# EAGLE schematic pic32 (EAGLE 9.3.0)
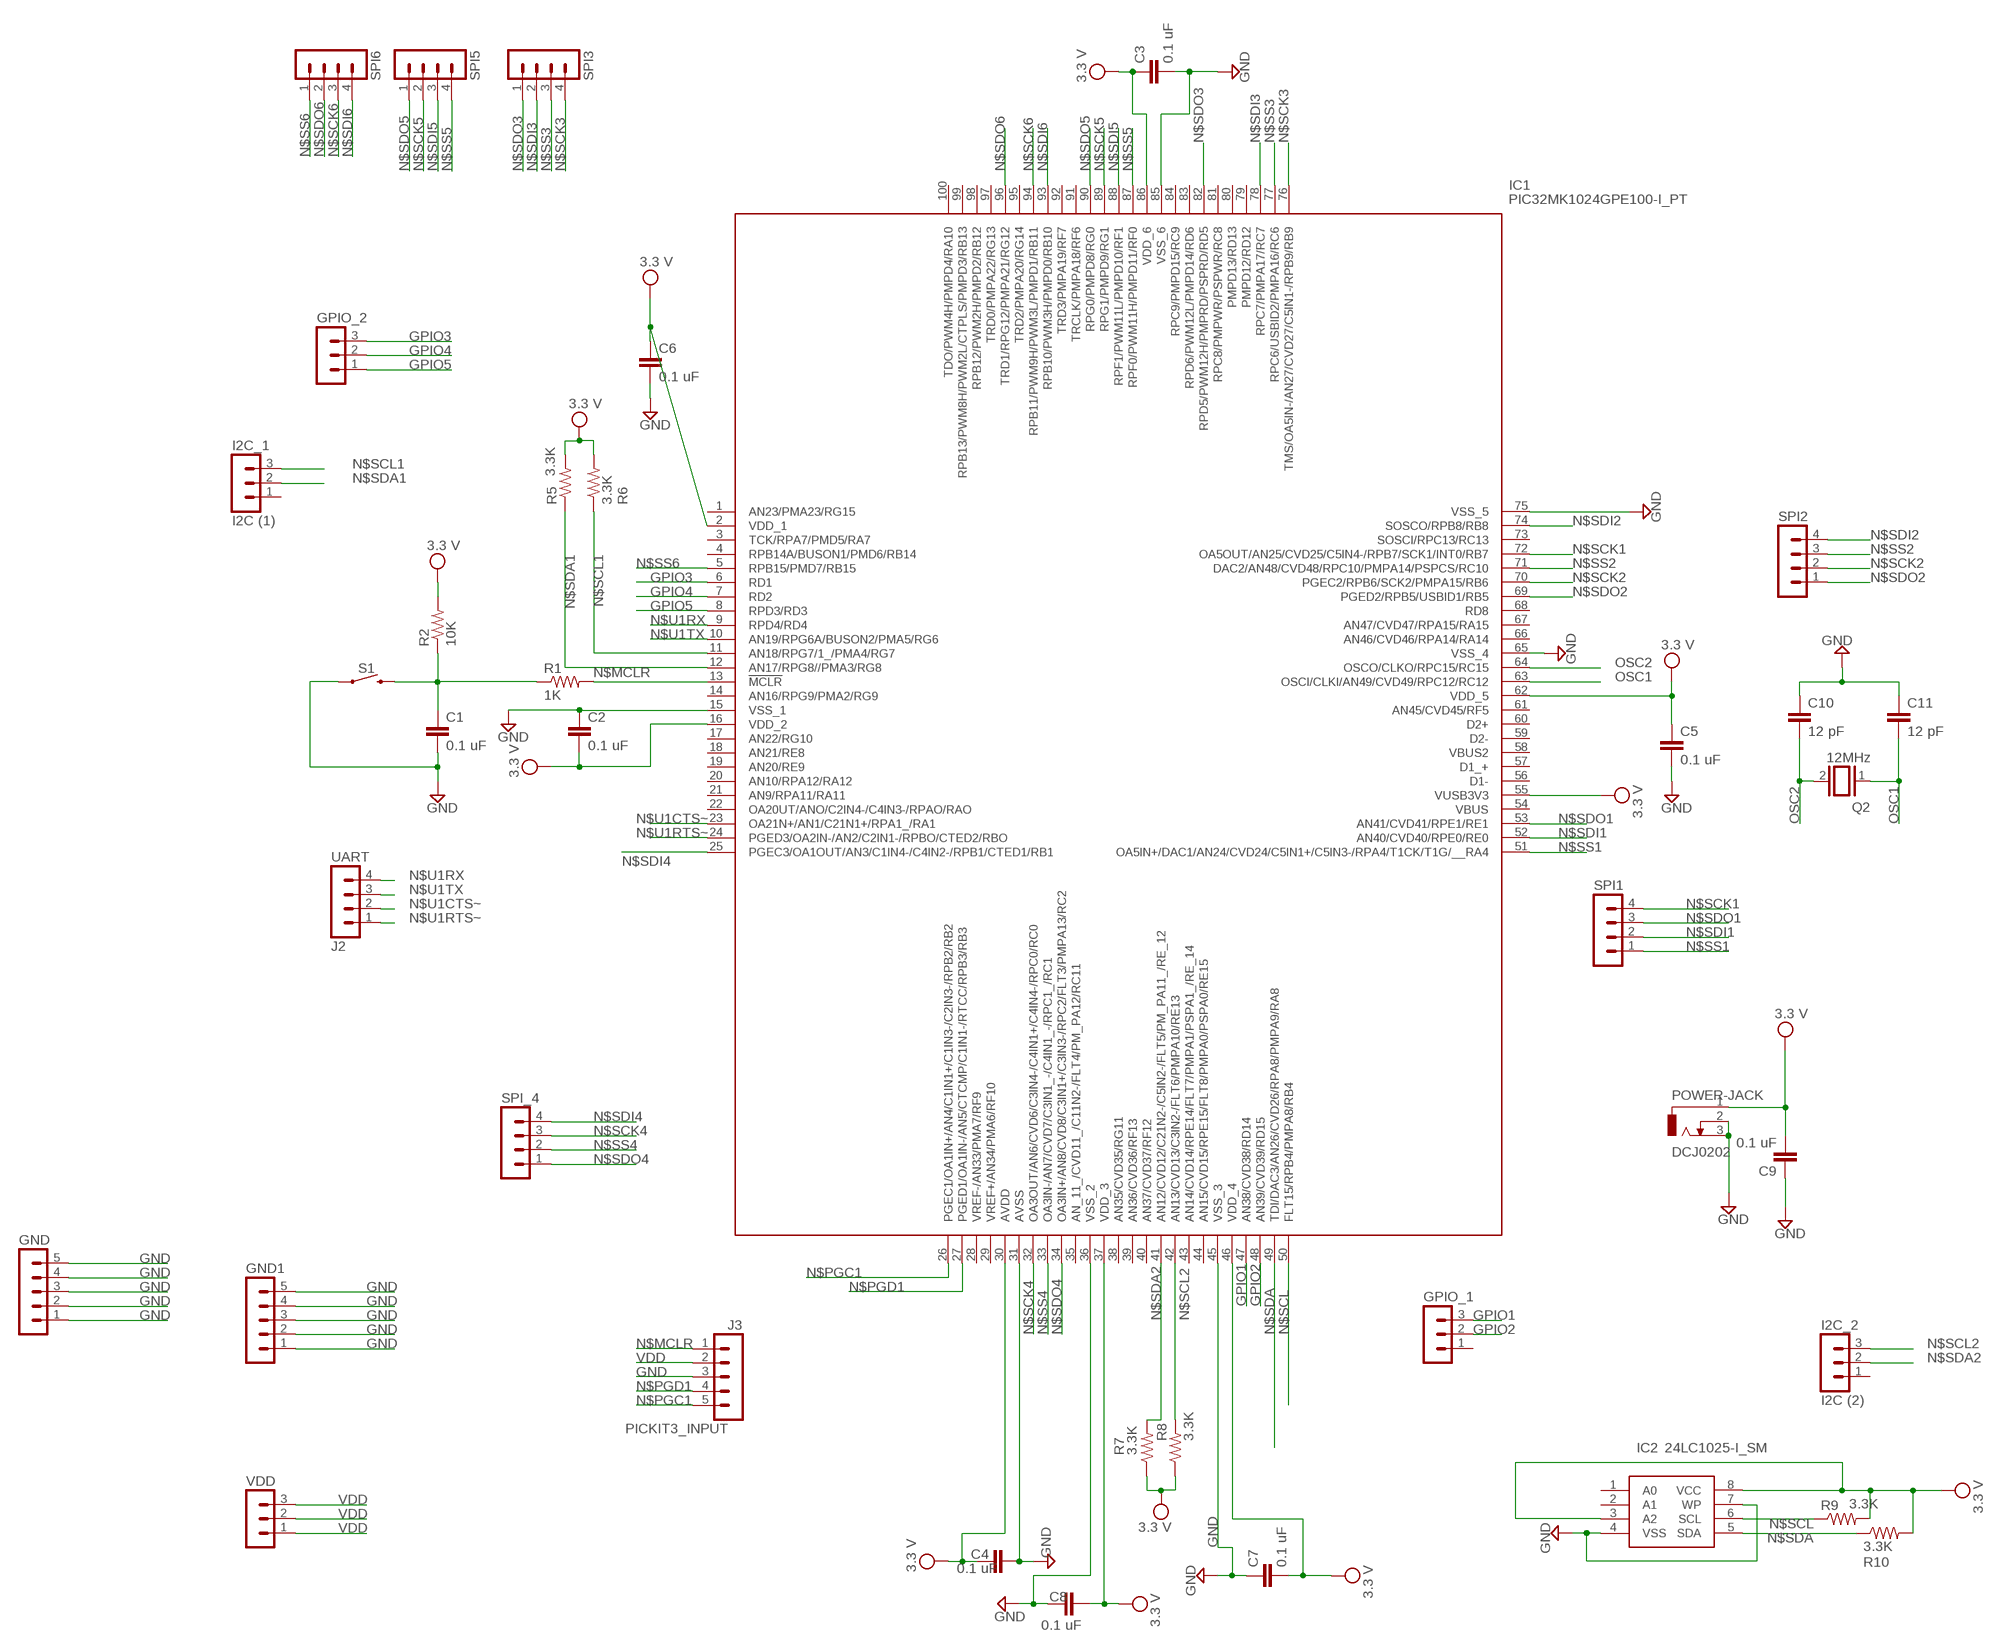
[diagram p0: schematic, sheet 1, part 1 of 2]
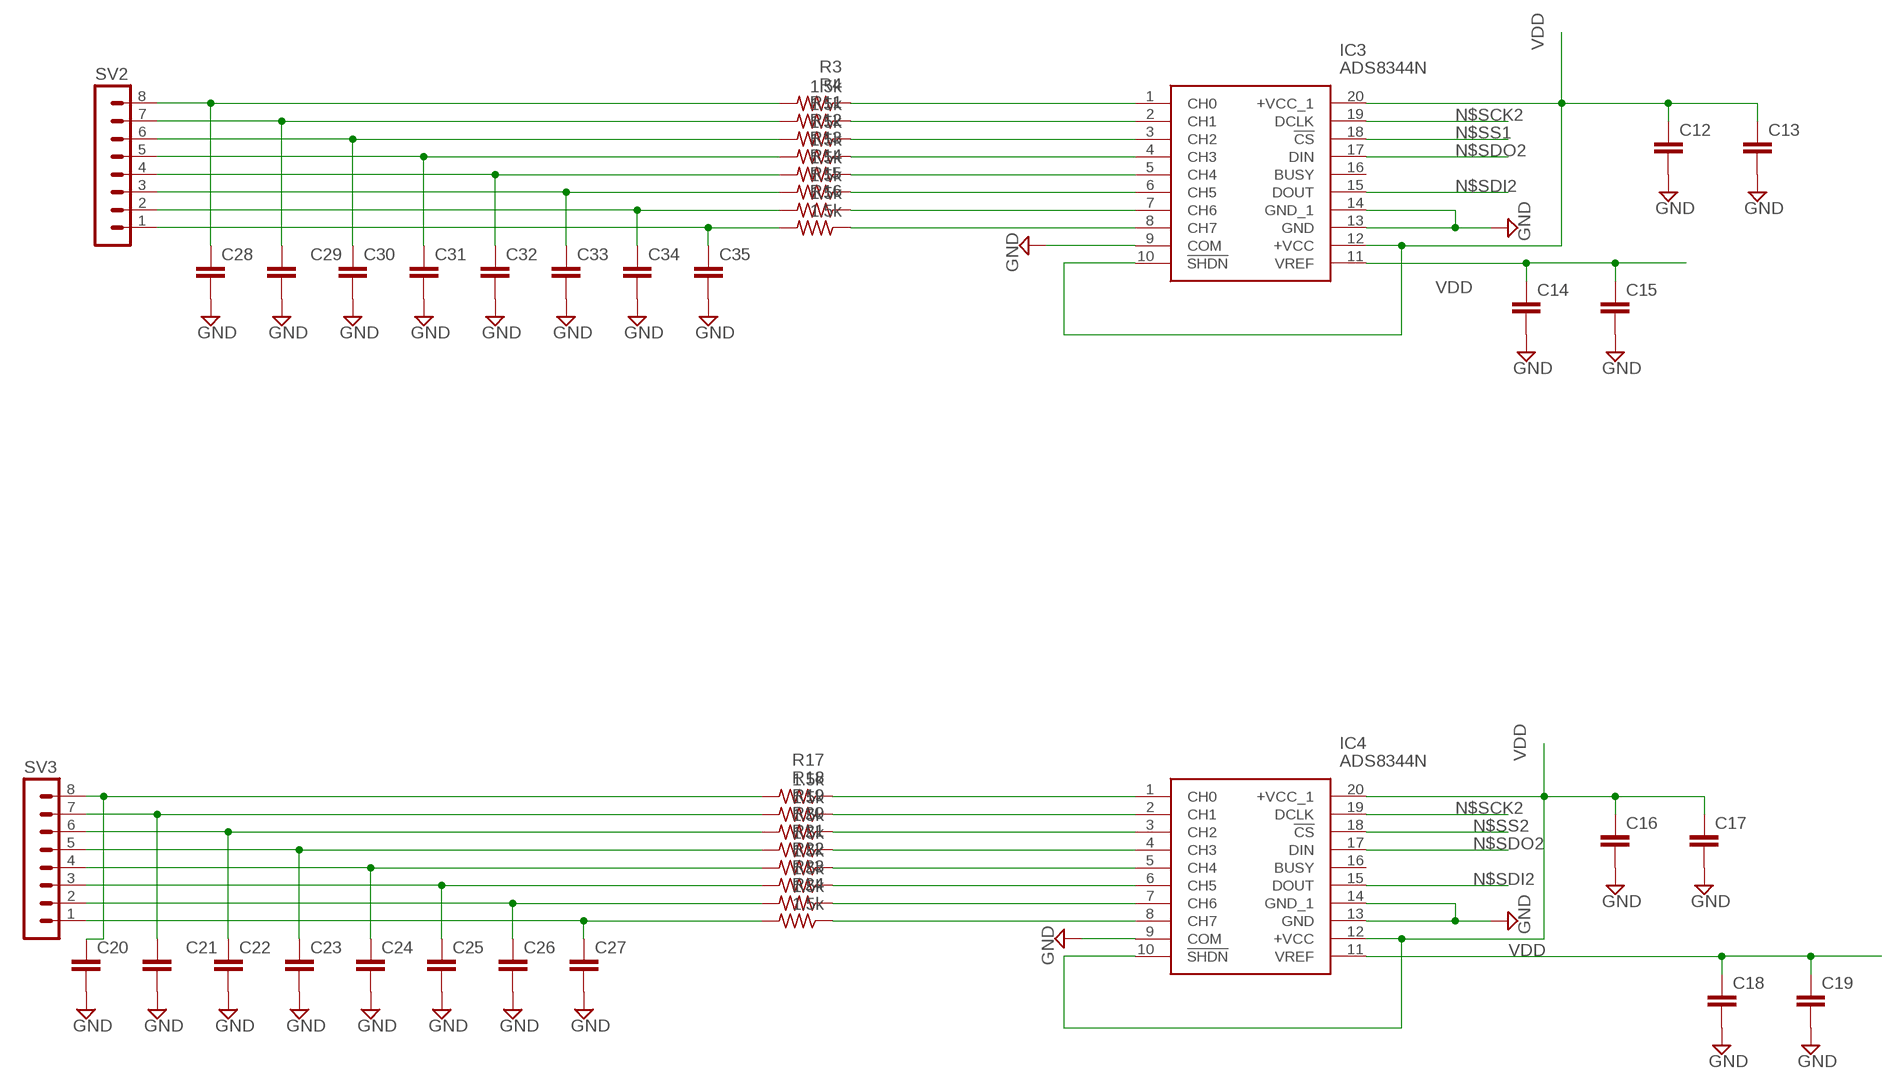
[diagram p1: schematic, sheet 1, part 2 of 2]

## Parts
C1  0.1 uF  C-EU025-025X050  [C025-025X050]
C2  0.1 uF  C-EU025-025X050  [C025-025X050]
C3  0.1 uF  C-EU025-025X050  [C025-025X050]
C4  0.1 uF  C-EU025-025X050  [C025-025X050]
C5  0.1 uF  C-EU025-025X050  [C025-025X050]
C6  0.1 uF  C-EU025-025X050  [C025-025X050]
C7  0.1 uF  C-EU025-025X050  [C025-025X050]
C8  0.1 uF  C-EU025-025X050  [C025-025X050]
C9  0.1 uF  C-EU025-025X050  [C025-025X050]
C10  12 pF  C-EU025-025X050  [C025-025X050]
C11  12 pF  C-EU025-025X050  [C025-025X050]
C12  0.1 uF  C-EU025-025X050  [C025-025X050]
C13  0.1 uF  C-EU025-025X050  [C025-025X050]
C14  0.1 uF  C-EU025-025X050  [C025-025X050]
C15  0.1 uF  C-EU025-025X050  [C025-025X050]
C16  0.1 uF  C-EU025-025X050  [C025-025X050]
C17  0.1 uF  C-EU025-025X050  [C025-025X050]
C18  0.1 uF  C-EU025-025X050  [C025-025X050]
C19  0.1 uF  C-EU025-025X050  [C025-025X050]
C20  0.1 uF  C-EU025-025X050  [C025-025X050]
C21  0.1 uF  C-EU025-025X050  [C025-025X050]
C22  0.1 uF  C-EU025-025X050  [C025-025X050]
C23  0.1 uF  C-EU025-025X050  [C025-025X050]
C24  0.1 uF  C-EU025-025X050  [C025-025X050]
C25  0.1 uF  C-EU025-025X050  [C025-025X050]
C26  0.1 uF  C-EU025-025X050  [C025-025X050]
C27  0.1 uF  C-EU025-025X050  [C025-025X050]
C28  0.1 uF  C-EU025-025X050  [C025-025X050]
C29  0.1 uF  C-EU025-025X050  [C025-025X050]
C30  0.1 uF  C-EU025-025X050  [C025-025X050]
C31  0.1 uF  C-EU025-025X050  [C025-025X050]
C32  0.1 uF  C-EU025-025X050  [C025-025X050]
C33  0.1 uF  C-EU025-025X050  [C025-025X050]
C34  0.1 uF  C-EU025-025X050  [C025-025X050]
C35  0.1 uF  C-EU025-025X050  [C025-025X050]
GND  MA05-1  [MA05-1]
GND1  MA05-1  [MA05-1]
GPIO_1  MA03-1  [MA03-1]
GPIO_2  MA03-1  [MA03-1]
I2C_1  I2C (1)  MA03-1  [MA03-1]
I2C_2  I2C (2)  MA03-1  [MA03-1]
IC1  PIC32MK1024GPE100-I_PT  [QFP40P1400X1400X120-100N]
IC2  24LC1025-I_SM  [SOIC127P794X203-8N]
IC3  ADS8344N  [SOP65P780X200-20N]
IC4  ADS8344N  [SOP65P780X200-20N]
PICKIT3_INPUT  J3  MA05-1  [MA05-1]
POWER-JACK  DCJ0202  [DCJ0202]
Q2  12MHz  XTAL/S  [QS]
R1  1K  R-US_0207/7  [0207/7]
R2  10K  R-US_0207/7  [0207/7]
R3  1.5k  R-US_0207/7  [0207/7]
R4  1.5k  R-US_0207/7  [0207/7]
R5  3.3K  R-US_0207/7  [0207/7]
R6  3.3K  R-US_0207/7  [0207/7]
R7  3.3K  R-US_0207/7  [0207/7]
R8  3.3K  R-US_0207/7  [0207/7]
R9  3.3K  R-US_0207/7  [0207/7]
R10  3.3K  R-US_0207/7  [0207/7]
R11  1.5k  R-US_0207/7  [0207/7]
R12  1.5k  R-US_0207/7  [0207/7]
R13  1.5k  R-US_0207/7  [0207/7]
R14  1.5k  R-US_0207/7  [0207/7]
R15  1.5k  R-US_0207/7  [0207/7]
R16  1.5k  R-US_0207/7  [0207/7]
R17  1.5k  R-US_0207/7  [0207/7]
R18  1.5k  R-US_0207/7  [0207/7]
R19  1.5k  R-US_0207/7  [0207/7]
R20  1.5k  R-US_0207/7  [0207/7]
R21  1.5k  R-US_0207/7  [0207/7]
R22  1.5k  R-US_0207/7  [0207/7]
R23  1.5k  R-US_0207/7  [0207/7]
R24  1.5k  R-US_0207/7  [0207/7]
S1  MOMENTARY-SWITCH-SPST-SMD-6.2MM-TALL  [TACTILE_SWITCH_SMD_6.2MM_TALL]
SPI1  MA04-1  [MA04-1]
SPI2  MA04-1  [MA04-1]
SPI3  MA04-1  [MA04-1]
SPI5  MA04-1  [MA04-1]
SPI6  MA04-1  [MA04-1]
SPI_4  MA04-1  [MA04-1]
SV2  MA08-1  [MA08-1]
SV3  MA08-1  [MA08-1]
UART  J2  MA04-1  [MA04-1]
VDD  MA03-1  [MA03-1]

## Nets
GND: C1.2 C2.1 C3.2 C4.1 C5.2 C6.2 C7.1 C8.1 C9.1 C10.1 C11.1 C12.2 C13.2 C14.2 C15.2 C16.2 C17.2 C18.2 C19.2 C20.2 C21.2 C22.2 C23.2 C24.2 C25.2 C26.2 C27.2 C28.2 C29.2 C30.2 C31.2 C32.2 C33.2 C34.2 C35.2 GND1.1 GND1.2 GND1.3 GND1.4 GND1.5 GND.1 GND.2 GND.3 GND.4 GND.5 IC1.15(VSS_1) IC1.31(AVSS) IC1.36(VSS_2) IC1.45(VSS_3) IC1.65(VSS_4) IC1.75(VSS_5) IC1.85(VSS_6) IC2.4(VSS) IC2.7(WP) IC3.9(COM) IC3.13(GND) IC3.14(GND_1) IC4.9(COM) IC4.13(GND) IC4.14(GND_1) PICKIT3_INPUT.3 POWER-JACK.2 POWER-JACK.3 S1.A2
GPIO1: GPIO_1.3 IC1.47(AN38/CVD38/RD14)
GPIO2: GPIO_1.2 IC1.48(AN39/CVD39/RD15)
GPIO3: GPIO_2.3 IC1.6(RD1)
GPIO4: GPIO_2.2 IC1.7(RD2)
GPIO5: GPIO_2.1 IC1.8(RPD3/RD3)
N$1: C1.1 R1.1 R2.1 S1.B2
N$2: C28.1 R3.2 SV2.8
N$3: IC3.1(CH0) R3.1
N$4: IC3.2(CH1) R4.1
N$5: IC3.3(CH2) R11.1
N$6: IC3.4(CH3) R12.1
N$7: IC3.5(CH4) R13.1
N$8: IC3.6(CH5) R14.1
N$9: IC3.7(CH6) R15.1
N$10: IC3.8(CH7) R16.1
N$11: IC4.1(CH0) R17.1
N$12: C29.1 R4.2 SV2.7
N$13: C30.1 R11.2 SV2.6
N$14: C31.1 R12.2 SV2.5
N$15: C32.1 R13.2 SV2.4
N$16: C33.1 R14.2 SV2.3
N$17: C34.1 R15.2 SV2.2
N$18: C35.1 R16.2 SV2.1
N$19: IC4.2(CH1) R18.1
N$20: IC4.3(CH2) R19.1
N$21: IC4.4(CH3) R20.1
N$22: C20.1 R17.2 SV3.8
N$23: C21.1 R18.2 SV3.7
N$24: C22.1 R19.2 SV3.6
N$25: C23.1 R20.2 SV3.5
N$26: C24.1 R21.2 SV3.4
N$27: C25.1 R22.2 SV3.3
N$28: C26.1 R23.2 SV3.2
N$29: C27.1 R24.2 SV3.1
N$30: IC4.5(CH4) R21.1
N$31: IC4.6(CH5) R22.1
N$32: IC4.7(CH6) R23.1
N$33: IC4.8(CH7) R24.1
N$MCLR: IC1.13(!MCLR) PICKIT3_INPUT.1 R1.2
N$PGC1: IC1.26(PGEC1/OA1IN+/AN4/C1IN1+/C1IN3-/C2IN3-/RPB2/RB2) PICKIT3_INPUT.5
N$PGD1: IC1.27(PGED1/OA1IN-/AN5/CTCMP/C1IN1-/RTCC/RPB3/RB3) PICKIT3_INPUT.4
N$SCK1: IC1.72(OA5OUT/AN25/CVD25/C5IN4-/RPB7/SCK1/INT0/RB7) SPI1.4
N$SCK2: IC1.70(PGEC2/RPB6/SCK2/PMPA15/RB6) IC3.19(DCLK) IC4.19(DCLK) SPI2.2
N$SCK3: IC1.76(TMS/OA5IN-/AN27/CVD27/C5IN1-/RPB9/RB9) SPI3.4
N$SCK4: IC1.32(OA3OUT/AN6/CVD6/C3IN4-/C4IN1+/C4IN4-/RPC0/RC0) SPI_4.3
N$SCK5: IC1.89(RPG1/PMPD9/RG1) SPI5.2
N$SCK6: IC1.94(RPB11/PWM9H/PWM3L/PMPD1/RB11) SPI6.3
N$SCL: IC1.50(FLT15/RPB4/PMPA8/RB4) IC2.6(SCL) R9.1
N$SCL1: I2C_1.3 IC1.11(AN18/RPG7/1_/PMA4/RG7) R6.1
N$SCL2: I2C_2.3 IC1.42(AN13/CVD13/C3IN2-/FLT6/PMPA10/RE13) R8.2
N$SDA: IC1.49(TDI/DAC3/AN26/CVD26/RPA8/PMPA9/RA8) IC2.5(SDA) R10.1
N$SDA1: I2C_1.2 IC1.12(AN17/RPG8//PMA3/RG8) R5.1
N$SDA2: I2C_2.2 IC1.41(AN12/CVD12/C21N2-/C5IN2-/FLT5/PM_PA11_/RE_12) R7.2
N$SDI1: IC1.52(AN40/CVD40/RPE0/RE0) SPI1.2
N$SDI2: IC1.74(SOSCO/RPB8/RB8) IC3.15(DOUT) IC4.15(DOUT) SPI2.4
N$SDI3: IC1.78(RPC7/PMPA17/RC7) SPI3.2
N$SDI4: IC1.25(PGEC3/OA1OUT/AN3/C1IN4-/C4IN2-/RPB1/CTED1/RB1) SPI_4.4
N$SDI5: IC1.88(RPF1/PWM11L/PMPD10/RF1) SPI5.3
N$SDI6: IC1.93(RPB10/PWM3H/PMPD0/RB10) SPI6.4
N$SDO1: IC1.53(AN41/CVD41/RPE1/RE1) SPI1.3
N$SDO2: IC1.69(PGED2/RPB5/USBID1/RB5) IC3.17(DIN) IC4.17(DIN) SPI2.1
N$SDO3: IC1.82(RPD5/PWM12H/PMPRD/PSPRD/RD5) SPI3.1
N$SDO4: IC1.34(OA3IN+/AN8/CVD8/C3IN1+/C3IN3-/RPC2/FLT3/PMPA13/RC2) SPI_4.1
N$SDO5: IC1.90(RPG0/PMPD8/RG0) SPI5.1
N$SDO6: IC1.96(TRD1/RPG12/PMPA21/RG12) SPI6.2
N$SS1: IC1.51(OA5IN+/DAC1/AN24/CVD24/C5IN1+/C5IN3-/RPA4/T1CK/T1G/__RA4) IC3.18(!CS) SPI1.1
N$SS2: IC1.71(DAC2/AN48/CVD48/RPC10/PMPA14/PSPCS/RC10) IC4.18(!CS) SPI2.3
N$SS3: IC1.77(RPC6/USBID2/PMPA16/RC6) SPI3.3
N$SS4: IC1.33(OA3IN-/AN7/CVD7/C3IN1_-/C4IN1_-/RPC1_/RC1) SPI_4.2
N$SS5: IC1.87(RPF0/PWM11H/PMPD11/RF0) SPI5.4
N$SS6: IC1.5(RPB15/PMD7/RB15) SPI6.1
N$U1CTS~: IC1.23(OA21N+/AN1/C21N1+/RPA1_/RA1) UART.2
N$U1RTS~: IC1.24(PGED3/OA2IN-/AN2/C2IN1-/RPBO/CTED2/RBO) UART.1
N$U1RX: IC1.9(RPD4/RD4) UART.4
N$U1TX: IC1.10(AN19/RPG6A/BUSON2/PMA5/RG6) UART.3
OSC1: C11.2 IC1.63(OSCI/CLKI/AN49/CVD49/RPC12/RC12) Q2.1
OSC2: C10.2 IC1.64(OSCO/CLKO/RPC15/RC15) Q2.2
VDD: C2.2 C3.1 C4.2 C5.1 C6.1 C7.2 C8.2 C9.2 C12.1 C13.1 C14.1 C15.1 C16.1 C17.1 C18.1 C19.1 IC1.2(VDD_1) IC1.16(VDD_2) IC1.30(AVDD) IC1.37(VDD_3) IC1.46(VDD_4) IC1.55(VUSB3V3) IC1.62(VDD_5) IC1.86(VDD_6) IC2.3(A2) IC2.8(VCC) IC3.10(!SHDN) IC3.11(VREF) IC3.12(+VCC) IC3.20(+VCC_1) IC4.10(!SHDN) IC4.11(VREF) IC4.12(+VCC) IC4.20(+VCC_1) PICKIT3_INPUT.2 POWER-JACK.1 R2.2 R5.2 R6.2 R7.1 R8.1 R9.2 R10.2 VDD.1 VDD.2 VDD.3 ; supply symbol labelled 3.3 V
Unconnected: GPIO_1.1 I2C_1.1 I2C_2.1 IC1.1(AN23/PMA23/RG15) IC1.3(TCK/RPA7/PMD5/RA7) IC1.4(RPB14A/BUSON1/PMD6/RB14) IC1.14(AN16/RPG9/PMA2/RG9) IC1.17(AN22/RG10) IC1.18(AN21/RE8) IC1.19(AN20/RE9) IC1.20(AN10/RPA12/RA12) IC1.21(AN9/RPA11/RA11) IC1.22(OA20UT/ANO/C2IN4-/C4IN3-/RPAO/RAO) IC1.28(VREF-/AN33/PMA7/RF9) IC1.29(VREF+/AN34/PMA6/RF10) IC1.35(AN_11_/CVD11_/C11N2-/FLT4/PM_PA12/RC11) IC1.38(AN35/CVD35/RG11) IC1.39(AN36/CVD36/RF13) IC1.40(AN37/CVD37/RF12) IC1.43(AN14/CVD14/RPE14/FLT7/PMPA1/PSPA1_/RE_14) IC1.44(AN15/CVD15/RPE15/FLT8/PMPA0/PSPA0/RE15) IC1.54(VBUS) IC1.56(D1-) IC1.57(D1_+) IC1.58(VBUS2) IC1.59(D2-) IC1.60(D2+) IC1.61(AN45/CVD45/RF5) IC1.66(AN46/CVD46/RPA14/RA14) IC1.67(AN47/CVD47/RPA15/RA15) IC1.68(RD8) IC1.73(SOSCI/RPC13/RC13) IC1.79(PMPD12/RD12) IC1.80(PMPD13/RD13) IC1.81(RPC8/PMPWR/PSPWR/RC8) IC1.83(RPD6/PWM12L/PMPD14/RD6) IC1.84(RPC9/PMPD15/RC9) IC1.91(TRCLK/PMPA18/RF6) IC1.92(TRD3/PMPA19/RF7) IC1.95(TRD2/PMPA20/RG14) IC1.97(TRD0/PMPA22/RG13) IC1.98(RPB12/PWM2H/PMPD2/RB12) IC1.99(RPB13/PWM8H/PWM2L/CTPLS/PMPD3/RB13) IC1.100(TDO/PWM4H/PMPD4/RA10) IC2.1(A0) IC2.2(A1) IC3.16(BUSY) IC4.16(BUSY)

## Library data of the parts
C1-C35 = rcl:C-EU: CAPACITOR, European symbol; SPICEPREFIX: C
GND GND1 PICKIT3_INPUT = con-lstb:MA05-1: PIN HEADER; OC_FARNELL: unknown; OC_NEWARK: unknown
GPIO_1 GPIO_2 I2C_1 I2C_2 VDD = con-lstb:MA03-1: PIN HEADER; OC_FARNELL: unknown; OC_NEWARK: unknown
IC1 = SamacSys_Parts:PIC32MK1024GPE100-I_PT: 32-bit Microcontrollers - MCU MCU32, 120MHz, 4 I2C, 6 I2S, USB FS, CAN 2.0B, 12-bit ADC Source: Datasheet <https://componentsearchengine.com/Datasheets/1/PIC32MK1024GPE100-I_PT.pdf>; DESCRIPTION: 32-bit Microcontrollers - MCU MCU32, 120MHz, 4 I2C, 6 I2S, USB FS, CAN 2.0B, 12-bit ADC; HEIGHT: 1.2mm; MANUFACTURER_NAME: Microchip; MANUFACTURER_PART_NUMBER: PIC32MK1024GPE100-I/PT; MOUSER_PART_NUMBER: 579-2MK1024GPE100IPT; MOUSER_PRICE-STOCK: https://www.mouser.com/Search/Refine.aspx?Keyword=579-2MK1024GPE100IPT
IC2 = 24LC1025-I_SM:24LC1025-I_SM: 1M 128Kx8 2.5V Ser. EEPROM,24LC1025-I/SM Source: Datasheet <https://componentsearchengine.com/Datasheets/1/24LC1025-I_SM.pdf>; DESCRIPTION: 1M 128Kx8 2.5V Ser. EEPROM,24LC1025-I/SM; HEIGHT: 2.03mm; MANUFACTURER_NAME: Microchip; MANUFACTURER_PART_NUMBER: 24LC1025-I/SM; MOUSER_PART_NUMBER: 579-24LC1025-I/SM; MOUSER_PRICE-STOCK: https://www.mouser.com/Search/Refine.aspx?Keyword=579-24LC1025-I%2FSM
IC3 IC4 = ADS8344N:ADS8344N: ADS8344N, 16-Bit Analogue to Digital Converter, Differential, Serial, 20-Pin SSOP Source: Datasheet <http://www.ti.com/lit/ds/symlink/ads8344.pdf>; DESCRIPTION: ADS8344N, 16-Bit Analogue to Digital Converter, Differential, Serial, 20-Pin SSOP; HEIGHT: 2mm; MANUFACTURER_NAME: Texas Instruments; MANUFACTURER_PART_NUMBER: ADS8344N; MOUSER_PART_NUMBER: 595-ADS8344N; MOUSER_PRICE-STOCK: https://www.mouser.com/Search/Refine.aspx?Keyword=595-ADS8344N
POWER-JACK = pic32:DCJ0202
Q2 = special:XTAL/S: CRYSTAL
R1-R24 = rcl:R-US_: RESISTOR, American symbol; SPICEPREFIX: R
S1 = SparkFun-Switches:MOMENTARY-SWITCH-SPST: Momentary Switch (Pushbutton) - SPST Normally-open (NO) SPST momentary switches (buttons, pushbuttons). Variants PTH-12MM - 12mm square, through-hole Momentary Pushbutton Switch - 12mm Square <https://www.sparkfun.com/products/9190> (COM-09190) PTH-6.0MM, PTH-6.0MM-KIT - 6.0mm square, through-hole Mini Pushbutton Switch <https://www.sparkfun.com/products/97> (COM-00097) KIT package intended for soldering kit's - only one side of pads' copper is exposed. PTH-RIGHT-ANGLE-KIT - Right-angle, through-hole Right Angle Tactile Button <https://www.sparkfun.com/products/10791> - Used on SparkFun BigTime Watch Kit <https://www.sparkfun.com/products/11734> SMD-12MM - 12mm square, surface-mount Tactile Button - SMD (12mm) <https://www.sparkfun.com/products/12993> (COM-12993) Used on SparkFun PicoBoard <https://www.sparkfun.com/products/11888> SMD-4.5MM - 4.5mm Square Trackball Switch Used on SparkFun Blackberry Trackballer Breakout <https://www.sparkfun.com/products/13169> SMD-4.6MMX2.8MM - 4.60mm x 2.80mm, surface mount Used on SparkFun SAMD21 Mini Breakout <https://www.sparkfun.com/products/13664> SMD-5.2MM, SMD-5.2-REDUNDANT - 5.2mm square, surface-mount Mini Pushbutton Switch - SMD <https://www.sparkfun.com/products/8720> (COM-08720) Used on Arduino Pro Mini <https://www.sparkfun.com/products/11114> REDUNDANT package connects both switch circuits together SMD-6.0X3.5MM - 6.0 x 3.5mm, surface mount Momentary Reset Switch SMD <https://www.sparkfun.com/products/8229> (COM-08229) SMD-6.2MM-TALL - 6.2mm square, surface mount Tactile Button - SMD (6mm) <https://www.sparkfun.com/products/12992> Used on SparkFun Digital Sandbox <https://www.sparkfun.com/products/12651> SMD-RIGHT-ANGLE - Right-angle, surface mount Used on SparkFun Block for Intel® Edison - Arduino <https://www.sparkfun.com/products/13036>; PROD_ID: SWCH-11966; SF_SKU: COM-12992
SPI1-SPI3 SPI5 SPI6 SPI_4 UART = con-lstb:MA04-1: PIN HEADER; OC_FARNELL: unknown; OC_NEWARK: unknown
SV2 SV3 = con-lstb:MA08-1: PIN HEADER; OC_FARNELL: unknown; OC_NEWARK: unknown